# Altium schematic sheet 15VDC Powersupply.SchDoc: 3.3VDC Powersupply
size Letter; Date: 2017-02-04; DocumentNumber: 8; Revision: A; SheetNumber: 8; SheetTotal: 16; DesignedBy: Craig Comberbach
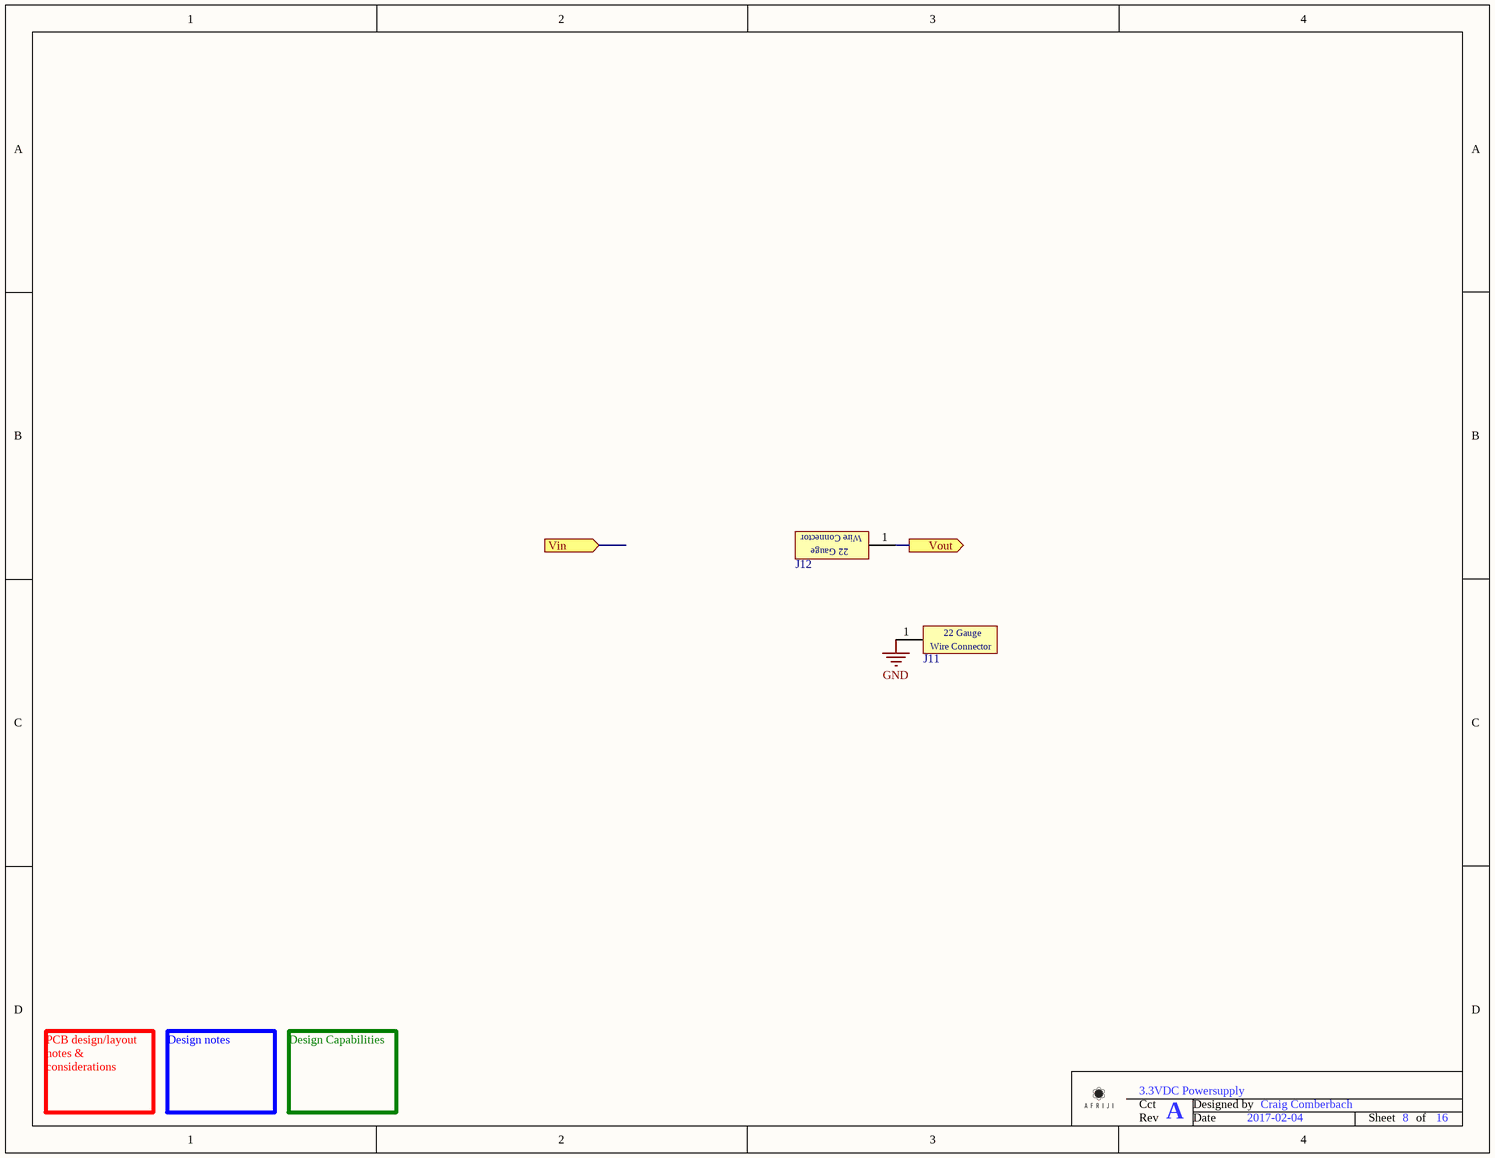
[diagram p0: 15VDC Powersupply.SchDoc]

## Parts
J11  1 Pin 22-Gauge Wire connector  [1 Pin 22-Gauge Wire Connector]  (value not drawn)  (no BOM)
J12  1 Pin 22-Gauge Wire connector  [1 Pin 22-Gauge Wire Connector]  (value not drawn)  (no BOM)

## Ports
Vin (in), Vout (out)

## Nets
GND: J11.1
Vout: J12.1 ; port Vout

## Notes on the sheet
- PCB design/layout notes & considerations
- Design notes
- Design Capabilities
- Cct
- Designed by
- Rev
- Date
- Sheet
- of
- (in symbol 1 Pin 22-Gauge Wire connector) 22 Gauge; Wire Connector